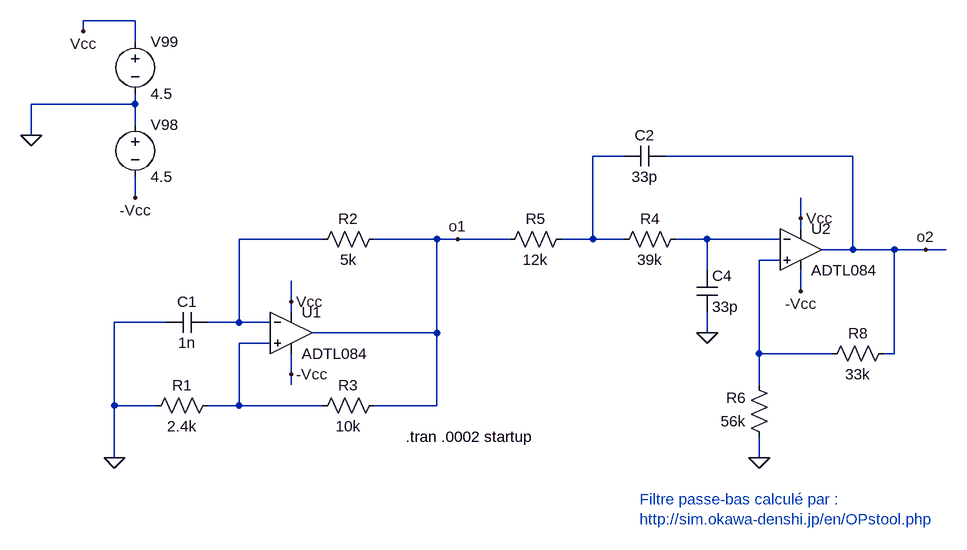
[diagram p0: schematic TL084_Oscillator.asc]
TL084_Oscillator.asc, the LTspice schematic file:
Version 4
SHEET 1 1544 680
WIRE 64 -160 -16 -160
WIRE -16 -144 -16 -160
WIRE 64 -128 64 -160
WIRE 64 -32 64 -48
WIRE 64 -32 -96 -32
WIRE 64 0 64 -32
WIRE -96 16 -96 -32
WIRE 816 48 768 48
WIRE 1168 48 880 48
WIRE 64 112 64 80
WIRE 1088 144 1088 112
WIRE 1088 160 1088 144
WIRE 352 176 224 176
WIRE 528 176 432 176
WIRE 560 176 528 176
WIRE 640 176 560 176
WIRE 768 176 768 48
WIRE 768 176 720 176
WIRE 816 176 768 176
WIRE 944 176 896 176
WIRE 1056 176 944 176
WIRE 1168 192 1168 48
WIRE 1168 192 1120 192
WIRE 1232 192 1168 192
WIRE 1280 192 1232 192
WIRE 1312 192 1280 192
WIRE 1056 208 1024 208
WIRE 944 224 944 176
WIRE 1088 256 1088 224
WIRE 304 272 304 240
WIRE 304 288 304 272
WIRE 112 304 32 304
WIRE 224 304 224 176
WIRE 224 304 176 304
WIRE 272 304 224 304
WIRE 528 320 528 176
WIRE 528 320 336 320
WIRE 944 320 944 288
WIRE 272 336 224 336
WIRE 1024 352 1024 208
WIRE 1136 352 1024 352
WIRE 1232 352 1232 192
WIRE 1232 352 1216 352
WIRE 304 384 304 352
WIRE 304 400 304 384
WIRE 1024 400 1024 352
WIRE 32 432 32 304
WIRE 96 432 32 432
WIRE 224 432 224 336
WIRE 224 432 176 432
WIRE 352 432 224 432
WIRE 528 432 528 320
WIRE 528 432 432 432
WIRE 32 512 32 432
WIRE 1024 512 1024 480
FLAG 32 512 0
FLAG -96 16 0
FLAG -16 -144 Vcc
FLAG 64 112 -Vcc
FLAG 304 272 Vcc
FLAG 304 384 -Vcc
FLAG 1088 144 Vcc
FLAG 1088 256 -Vcc
FLAG 560 176 o1
FLAG 1280 192 o2
FLAG 1024 512 0
FLAG 944 320 0
SYMBOL Opamps/ADTL084 304 256 R0
SYMATTR InstName U1
SYMBOL res 192 416 R90
WINDOW 0 0 56 VBottom 2
WINDOW 3 32 56 VTop 2
SYMATTR InstName R1
SYMATTR Value 2.4k
SYMBOL res 448 416 R90
WINDOW 0 0 56 VBottom 2
WINDOW 3 32 56 VTop 2
SYMATTR InstName R3
SYMATTR Value 10k
SYMBOL res 448 160 R90
WINDOW 0 0 56 VBottom 2
WINDOW 3 32 56 VTop 2
SYMATTR InstName R2
SYMATTR Value 5k
SYMBOL cap 176 288 R90
WINDOW 0 0 32 VBottom 2
WINDOW 3 32 32 VTop 2
SYMATTR InstName C1
SYMATTR Value 1n
SYMBOL voltage 64 -144 R0
SYMATTR InstName V99
SYMATTR Value 4.5
SYMBOL voltage 64 -16 R0
SYMATTR InstName V98
SYMATTR Value 4.5
SYMBOL Opamps/ADTL084 1088 128 R0
SYMATTR InstName U2
SYMBOL res 736 160 R90
WINDOW 0 0 56 VBottom 2
WINDOW 3 32 56 VTop 2
SYMATTR InstName R5
SYMATTR Value 12k
SYMBOL cap 880 32 R90
WINDOW 0 0 32 VBottom 2
WINDOW 3 32 32 VTop 2
SYMATTR InstName C2
SYMATTR Value 33p
SYMBOL res 912 160 R90
WINDOW 0 0 56 VBottom 2
WINDOW 3 32 56 VTop 2
SYMATTR InstName R4
SYMATTR Value 39k
SYMBOL res 1040 496 R180
WINDOW 0 36 76 Left 2
WINDOW 3 36 40 Left 2
SYMATTR InstName R6
SYMATTR Value 56k
SYMBOL res 1120 368 R270
WINDOW 0 32 56 VTop 2
WINDOW 3 0 56 VBottom 2
SYMATTR InstName R8
SYMATTR Value 33k
SYMBOL cap 928 224 R0
SYMATTR InstName C4
SYMATTR Value 33p
TEXT 480 480 Left 2 !.tran .0002 startup
TEXT 840 576 Left 2 ;Filtre passe-bas calculé par :\nhttp://sim.okawa-denshi.jp/en/OPstool.php

The netlist it stands for:
* TL084_Oscillator.asc
XU1 N005 N002 Vcc -Vcc o1 ADTL084  ; pins In+ In- V+ V- OUT
R1 N005 0 2.4k
R3 o1 N005 10k
R2 o1 N002 5k
C1 N002 0 1n
V99 Vcc 0 4.5
V98 0 -Vcc 4.5
XU2 N004 N003 Vcc -Vcc o2 ADTL084  ; pins In+ In- V+ V- OUT
R5 N001 o1 12k
C2 o2 N001 33p
R4 N003 N001 39k
R6 0 N004 56k
R8 N004 o2 33k
C4 N003 0 33p
.tran .0002 startup
* Filtre passe-bas calculé par :
* http://sim.okawa-denshi.jp/en/OPstool.php
.lib ADTL084.lib
.backanno
.end